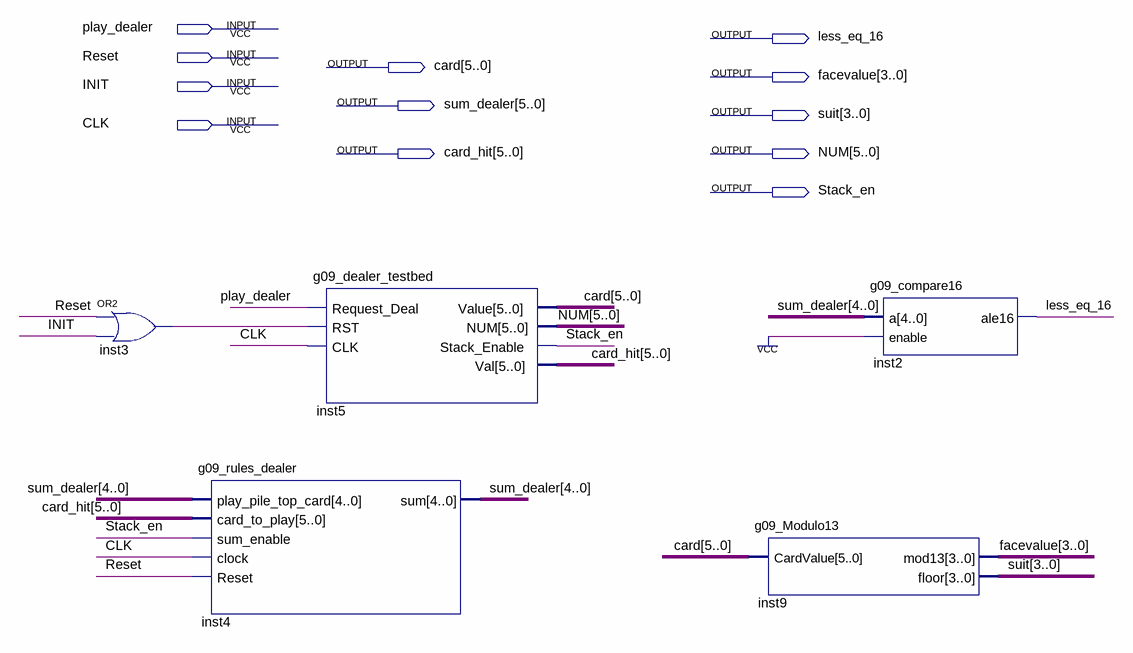
[diagram p0: schematic sheet]
// Quartus schematic g09_datapath_testing.bdf as structural Verilog: 5 symbols, 12 pins
module g09_datapath_testing (
  input  play_dealer,
  input  Reset,
  input  INIT,
  input  CLK,
  output less_eq_16,
  output [5:0] card,
  output [3:0] facevalue,
  output [5:0] sum_dealer,
  output [3:0] suit,
  output [5:0] card_hit,
  output [5:0] NUM,
  output Stack_en
);

  wire inst3_out;

  or inst3 (inst3_out, Reset, INIT);
  g09_rules_dealer inst4 (
    .play_pile_top_card(sum_dealer[4:0]), .card_to_play(card_hit), .sum_enable(Stack_en), .clock(CLK),
    .Reset(Reset), .sum(sum_dealer[4:0]));
  g09_dealer_testbed inst5 (
    .Request_Deal(play_dealer), .RST(inst3_out), .CLK(CLK), .Value(card), .NUM(NUM), .Stack_Enable(Stack_en),
    .Val(card_hit));
  g09_Modulo13 inst9 (.CardValue(card), .mod13(facevalue), .floor(suit));
  g09_compare16 inst2 (.a(sum_dealer[4:0]), .enable(1'b1), .ale16(less_eq_16));
endmodule
